# EAGLE design Sensor_HallArray_StandAlone_5mm (EAGLE 9.6.2)
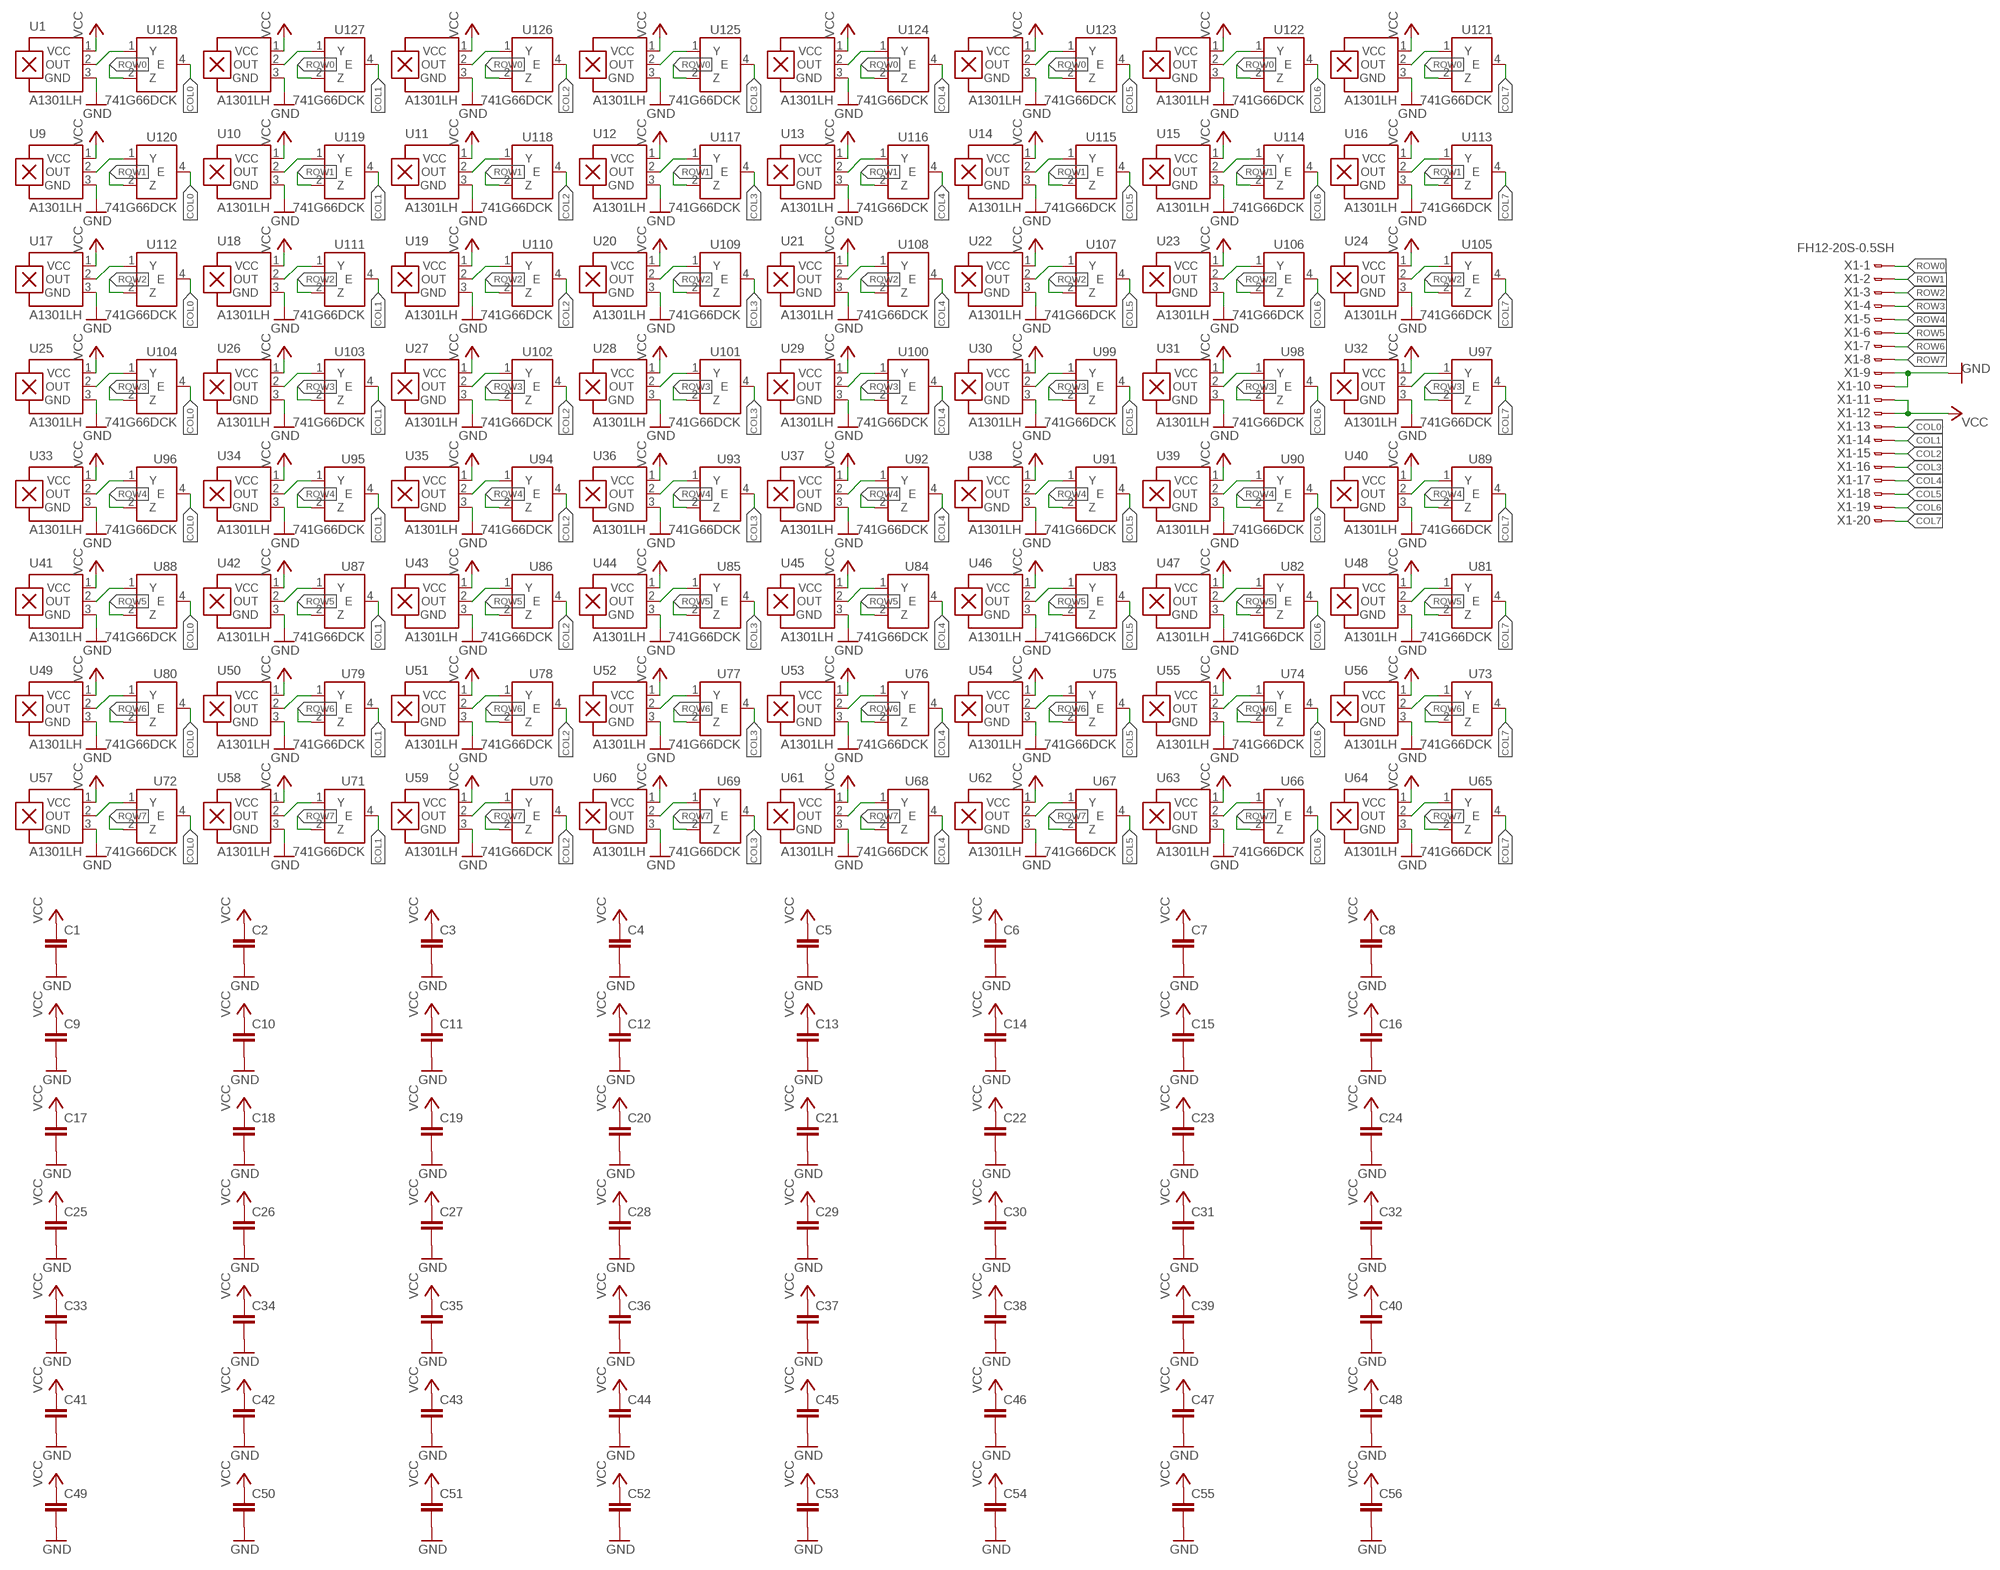
[diagram p0: schematic, sheet 1]

## Parts
C1  C-EUC0402  [C0402]
C2  C-EUC0402  [C0402]
C3  C-EUC0402  [C0402]
C4  C-EUC0402  [C0402]
C5  C-EUC0402  [C0402]
C6  C-EUC0402  [C0402]
C7  C-EUC0402  [C0402]
C8  C-EUC0402  [C0402]
C9  C-EUC0402  [C0402]
C10  C-EUC0402  [C0402]
C11  C-EUC0402  [C0402]
C12  C-EUC0402  [C0402]
C13  C-EUC0402  [C0402]
C14  C-EUC0402  [C0402]
C15  C-EUC0402  [C0402]
C16  C-EUC0402  [C0402]
C17  C-EUC0402  [C0402]
C18  C-EUC0402  [C0402]
C19  C-EUC0402  [C0402]
C20  C-EUC0402  [C0402]
C21  C-EUC0402  [C0402]
C22  C-EUC0402  [C0402]
C23  C-EUC0402  [C0402]
C24  C-EUC0402  [C0402]
C25  C-EUC0402  [C0402]
C26  C-EUC0402  [C0402]
C27  C-EUC0402  [C0402]
C28  C-EUC0402  [C0402]
C29  C-EUC0402  [C0402]
C30  C-EUC0402  [C0402]
C31  C-EUC0402  [C0402]
C32  C-EUC0402  [C0402]
C33  C-EUC0402  [C0402]
C34  C-EUC0402  [C0402]
C35  C-EUC0402  [C0402]
C36  C-EUC0402  [C0402]
C37  C-EUC0402  [C0402]
C38  C-EUC0402  [C0402]
C39  C-EUC0402  [C0402]
C40  C-EUC0402  [C0402]
C41  C-EUC0402  [C0402]
C42  C-EUC0402  [C0402]
C43  C-EUC0402  [C0402]
C44  C-EUC0402  [C0402]
C45  C-EUC0402  [C0402]
C46  C-EUC0402  [C0402]
C47  C-EUC0402  [C0402]
C48  C-EUC0402  [C0402]
C49  C-EUC0402  [C0402]
C50  C-EUC0402  [C0402]
C51  C-EUC0402  [C0402]
C52  C-EUC0402  [C0402]
C53  C-EUC0402  [C0402]
C54  C-EUC0402  [C0402]
C55  C-EUC0402  [C0402]
C56  C-EUC0402  [C0402]
U1  A1301LH  [SOT23-W]
U2  A1301LH  [SOT23-W]
U3  A1301LH  [SOT23-W]
U4  A1301LH  [SOT23-W]
U5  A1301LH  [SOT23-W]
U6  A1301LH  [SOT23-W]
U7  A1301LH  [SOT23-W]
U8  A1301LH  [SOT23-W]
U9  A1301LH  [SOT23-W]
U10  A1301LH  [SOT23-W]
U11  A1301LH  [SOT23-W]
U12  A1301LH  [SOT23-W]
U13  A1301LH  [SOT23-W]
U14  A1301LH  [SOT23-W]
U15  A1301LH  [SOT23-W]
U16  A1301LH  [SOT23-W]
U17  A1301LH  [SOT23-W]
U18  A1301LH  [SOT23-W]
U19  A1301LH  [SOT23-W]
U20  A1301LH  [SOT23-W]
U21  A1301LH  [SOT23-W]
U22  A1301LH  [SOT23-W]
U23  A1301LH  [SOT23-W]
U24  A1301LH  [SOT23-W]
U25  A1301LH  [SOT23-W]
U26  A1301LH  [SOT23-W]
U27  A1301LH  [SOT23-W]
U28  A1301LH  [SOT23-W]
U29  A1301LH  [SOT23-W]
U30  A1301LH  [SOT23-W]
U31  A1301LH  [SOT23-W]
U32  A1301LH  [SOT23-W]
U33  A1301LH  [SOT23-W]
U34  A1301LH  [SOT23-W]
U35  A1301LH  [SOT23-W]
U36  A1301LH  [SOT23-W]
U37  A1301LH  [SOT23-W]
U38  A1301LH  [SOT23-W]
U39  A1301LH  [SOT23-W]
U40  A1301LH  [SOT23-W]
U41  A1301LH  [SOT23-W]
U42  A1301LH  [SOT23-W]
U43  A1301LH  [SOT23-W]
U44  A1301LH  [SOT23-W]
U45  A1301LH  [SOT23-W]
U46  A1301LH  [SOT23-W]
U47  A1301LH  [SOT23-W]
U48  A1301LH  [SOT23-W]
U49  A1301LH  [SOT23-W]
U50  A1301LH  [SOT23-W]
U51  A1301LH  [SOT23-W]
U52  A1301LH  [SOT23-W]
U53  A1301LH  [SOT23-W]
U54  A1301LH  [SOT23-W]
U55  A1301LH  [SOT23-W]
U56  A1301LH  [SOT23-W]
U57  A1301LH  [SOT23-W]
U58  A1301LH  [SOT23-W]
U59  A1301LH  [SOT23-W]
U60  A1301LH  [SOT23-W]
U61  A1301LH  [SOT23-W]
U62  A1301LH  [SOT23-W]
U63  A1301LH  [SOT23-W]
U64  A1301LH  [SOT23-W]
U65  741G66DCK  [SC70-5]
U66  741G66DCK  [SC70-5]
U67  741G66DCK  [SC70-5]
U68  741G66DCK  [SC70-5]
U69  741G66DCK  [SC70-5]
U70  741G66DCK  [SC70-5]
U71  741G66DCK  [SC70-5]
U72  741G66DCK  [SC70-5]
U73  741G66DCK  [SC70-5]
U74  741G66DCK  [SC70-5]
U75  741G66DCK  [SC70-5]
U76  741G66DCK  [SC70-5]
U77  741G66DCK  [SC70-5]
U78  741G66DCK  [SC70-5]
U79  741G66DCK  [SC70-5]
U80  741G66DCK  [SC70-5]
U81  741G66DCK  [SC70-5]
U82  741G66DCK  [SC70-5]
U83  741G66DCK  [SC70-5]
U84  741G66DCK  [SC70-5]
U85  741G66DCK  [SC70-5]
U86  741G66DCK  [SC70-5]
U87  741G66DCK  [SC70-5]
U88  741G66DCK  [SC70-5]
U89  741G66DCK  [SC70-5]
U90  741G66DCK  [SC70-5]
U91  741G66DCK  [SC70-5]
U92  741G66DCK  [SC70-5]
U93  741G66DCK  [SC70-5]
U94  741G66DCK  [SC70-5]
U95  741G66DCK  [SC70-5]
U96  741G66DCK  [SC70-5]
U97  741G66DCK  [SC70-5]
U98  741G66DCK  [SC70-5]
U99  741G66DCK  [SC70-5]
U100  741G66DCK  [SC70-5]
U101  741G66DCK  [SC70-5]
U102  741G66DCK  [SC70-5]
U103  741G66DCK  [SC70-5]
U104  741G66DCK  [SC70-5]
U105  741G66DCK  [SC70-5]
U106  741G66DCK  [SC70-5]
U107  741G66DCK  [SC70-5]
U108  741G66DCK  [SC70-5]
U109  741G66DCK  [SC70-5]
U110  741G66DCK  [SC70-5]
U111  741G66DCK  [SC70-5]
U112  741G66DCK  [SC70-5]
U113  741G66DCK  [SC70-5]
U114  741G66DCK  [SC70-5]
U115  741G66DCK  [SC70-5]
U116  741G66DCK  [SC70-5]
U117  741G66DCK  [SC70-5]
U118  741G66DCK  [SC70-5]
U119  741G66DCK  [SC70-5]
U120  741G66DCK  [SC70-5]
U121  741G66DCK  [SC70-5]
U122  741G66DCK  [SC70-5]
U123  741G66DCK  [SC70-5]
U124  741G66DCK  [SC70-5]
U125  741G66DCK  [SC70-5]
U126  741G66DCK  [SC70-5]
U127  741G66DCK  [SC70-5]
U128  741G66DCK  [SC70-5]
X1  FH12-20S-0.5SH  [FH12-20S-0.5SH]

## Nets
COL0: U72.4(E) U80.4(E) U88.4(E) U96.4(E) U104.4(E) U112.4(E) U120.4(E) U128.4(E) X1.13
COL1: U71.4(E) U79.4(E) U87.4(E) U95.4(E) U103.4(E) U111.4(E) U119.4(E) U127.4(E) X1.14
COL2: U70.4(E) U78.4(E) U86.4(E) U94.4(E) U102.4(E) U110.4(E) U118.4(E) U126.4(E) X1.15
COL3: U69.4(E) U77.4(E) U85.4(E) U93.4(E) U101.4(E) U109.4(E) U117.4(E) U125.4(E) X1.16
COL4: U68.4(E) U76.4(E) U84.4(E) U92.4(E) U100.4(E) U108.4(E) U116.4(E) U124.4(E) X1.17
COL5: U67.4(E) U75.4(E) U83.4(E) U91.4(E) U99.4(E) U107.4(E) U115.4(E) U123.4(E) X1.18
COL6: U66.4(E) U74.4(E) U82.4(E) U90.4(E) U98.4(E) U106.4(E) U114.4(E) U122.4(E) X1.19
COL7: U65.4(E) U73.4(E) U81.4(E) U89.4(E) U97.4(E) U105.4(E) U113.4(E) U121.4(E) X1.20
GND: C1.2 C2.2 C3.2 C4.2 C5.2 C6.2 C7.2 C8.2 C9.2 C10.2 C11.2 C12.2 C13.2 C14.2 C15.2 C16.2 C17.2 C18.2 C19.2 C20.2 C21.2 C22.2 C23.2 C24.2 C25.2 C26.2 C27.2 C28.2 C29.2 C30.2 C31.2 C32.2 C33.2 C34.2 C35.2 C36.2 C37.2 C38.2 C39.2 C40.2 C41.2 C42.2 C43.2 C44.2 C45.2 C46.2 C47.2 C48.2 C49.2 C50.2 C51.2 C52.2 C53.2 C54.2 C55.2 C56.2 U1.3(GND) U2.3(GND) U3.3(GND) U4.3(GND) U5.3(GND) U6.3(GND) U7.3(GND) U8.3(GND) U9.3(GND) U10.3(GND) U11.3(GND) U12.3(GND) U13.3(GND) U14.3(GND) U15.3(GND) U16.3(GND) U17.3(GND) U18.3(GND) U19.3(GND) U20.3(GND) U21.3(GND) U22.3(GND) U23.3(GND) U24.3(GND) U25.3(GND) U26.3(GND) U27.3(GND) U28.3(GND) U29.3(GND) U30.3(GND) U31.3(GND) U32.3(GND) U33.3(GND) U34.3(GND) U35.3(GND) U36.3(GND) U37.3(GND) U38.3(GND) U39.3(GND) U40.3(GND) U41.3(GND) U42.3(GND) U43.3(GND) U44.3(GND) U45.3(GND) U46.3(GND) U47.3(GND) U48.3(GND) U49.3(GND) U50.3(GND) U51.3(GND) U52.3(GND) U53.3(GND) U54.3(GND) U55.3(GND) U56.3(GND) U57.3(GND) U58.3(GND) U59.3(GND) U60.3(GND) U61.3(GND) U62.3(GND) U63.3(GND) U64.3(GND) X1.9 X1.10
N$00001: U1.2(OUT) U128.1(Y)
N$00002: U2.2(OUT) U127.1(Y)
N$00003: U9.2(OUT) U120.1(Y)
N$00004: U3.2(OUT) U126.1(Y)
N$00005: U4.2(OUT) U125.1(Y)
N$00006: U5.2(OUT) U124.1(Y)
N$00007: U6.2(OUT) U123.1(Y)
N$00008: U7.2(OUT) U122.1(Y)
N$00009: U8.2(OUT) U121.1(Y)
N$00010: U10.2(OUT) U119.1(Y)
N$00011: U11.2(OUT) U118.1(Y)
N$00012: U12.2(OUT) U117.1(Y)
N$00013: U13.2(OUT) U116.1(Y)
N$00014: U14.2(OUT) U115.1(Y)
N$00015: U15.2(OUT) U114.1(Y)
N$00016: U16.2(OUT) U113.1(Y)
N$00017: U17.2(OUT) U112.1(Y)
N$00018: U18.2(OUT) U111.1(Y)
N$00019: U19.2(OUT) U110.1(Y)
N$00020: U20.2(OUT) U109.1(Y)
N$00021: U21.2(OUT) U108.1(Y)
N$00022: U22.2(OUT) U107.1(Y)
N$00023: U23.2(OUT) U106.1(Y)
N$00024: U24.2(OUT) U105.1(Y)
N$00025: U25.2(OUT) U104.1(Y)
N$00026: U26.2(OUT) U103.1(Y)
N$00029: U27.2(OUT) U102.1(Y)
N$00030: U28.2(OUT) U101.1(Y)
N$00031: U29.2(OUT) U100.1(Y)
N$00032: U30.2(OUT) U99.1(Y)
N$00033: U31.2(OUT) U98.1(Y)
N$00034: U32.2(OUT) U97.1(Y)
N$00035: U33.2(OUT) U96.1(Y)
N$00036: U34.2(OUT) U95.1(Y)
N$00037: U35.2(OUT) U94.1(Y)
N$00038: U36.2(OUT) U93.1(Y)
N$00039: U37.2(OUT) U92.1(Y)
N$00040: U38.2(OUT) U91.1(Y)
N$00041: U39.2(OUT) U90.1(Y)
N$00042: U40.2(OUT) U89.1(Y)
N$00043: U41.2(OUT) U88.1(Y)
N$00045: U42.2(OUT) U87.1(Y)
N$00046: U43.2(OUT) U86.1(Y)
N$00047: U44.2(OUT) U85.1(Y)
N$00048: U45.2(OUT) U84.1(Y)
N$00049: U46.2(OUT) U83.1(Y)
N$00051: U47.2(OUT) U82.1(Y)
N$00052: U48.2(OUT) U81.1(Y)
N$00053: U49.2(OUT) U80.1(Y)
N$00054: U50.2(OUT) U79.1(Y)
N$00055: U51.2(OUT) U78.1(Y)
N$00056: U52.2(OUT) U77.1(Y)
N$00057: U53.2(OUT) U76.1(Y)
N$00058: U54.2(OUT) U75.1(Y)
N$00059: U55.2(OUT) U74.1(Y)
N$00060: U56.2(OUT) U73.1(Y)
N$00061: U57.2(OUT) U72.1(Y)
N$00062: U58.2(OUT) U71.1(Y)
N$00063: U59.2(OUT) U70.1(Y)
N$00064: U60.2(OUT) U69.1(Y)
N$00065: U61.2(OUT) U68.1(Y)
N$00066: U62.2(OUT) U67.1(Y)
N$00067: U63.2(OUT) U66.1(Y)
N$00068: U64.2(OUT) U65.1(Y)
ROW0: U121.2(Z) U122.2(Z) U123.2(Z) U124.2(Z) U125.2(Z) U126.2(Z) U127.2(Z) U128.2(Z) X1.1
ROW1: U113.2(Z) U114.2(Z) U115.2(Z) U116.2(Z) U117.2(Z) U118.2(Z) U119.2(Z) U120.2(Z) X1.2
ROW2: U105.2(Z) U106.2(Z) U107.2(Z) U108.2(Z) U109.2(Z) U110.2(Z) U111.2(Z) U112.2(Z) X1.3
ROW3: U97.2(Z) U98.2(Z) U99.2(Z) U100.2(Z) U101.2(Z) U102.2(Z) U103.2(Z) U104.2(Z) X1.4
ROW4: U89.2(Z) U90.2(Z) U91.2(Z) U92.2(Z) U93.2(Z) U94.2(Z) U95.2(Z) U96.2(Z) X1.5
ROW5: U81.2(Z) U82.2(Z) U83.2(Z) U84.2(Z) U85.2(Z) U86.2(Z) U87.2(Z) U88.2(Z) X1.6
ROW6: U73.2(Z) U74.2(Z) U75.2(Z) U76.2(Z) U77.2(Z) U78.2(Z) U79.2(Z) U80.2(Z) X1.7
ROW7: U65.2(Z) U66.2(Z) U67.2(Z) U68.2(Z) U69.2(Z) U70.2(Z) U71.2(Z) U72.2(Z) X1.8
VCC: C1.1 C2.1 C3.1 C4.1 C5.1 C6.1 C7.1 C8.1 C9.1 C10.1 C11.1 C12.1 C13.1 C14.1 C15.1 C16.1 C17.1 C18.1 C19.1 C20.1 C21.1 C22.1 C23.1 C24.1 C25.1 C26.1 C27.1 C28.1 C29.1 C30.1 C31.1 C32.1 C33.1 C34.1 C35.1 C36.1 C37.1 C38.1 C39.1 C40.1 C41.1 C42.1 C43.1 C44.1 C45.1 C46.1 C47.1 C48.1 C49.1 C50.1 C51.1 C52.1 C53.1 C54.1 C55.1 C56.1 U1.1(VCC) U2.1(VCC) U3.1(VCC) U4.1(VCC) U5.1(VCC) U6.1(VCC) U7.1(VCC) U8.1(VCC) U9.1(VCC) U10.1(VCC) U11.1(VCC) U12.1(VCC) U13.1(VCC) U14.1(VCC) U15.1(VCC) U16.1(VCC) U17.1(VCC) U18.1(VCC) U19.1(VCC) U20.1(VCC) U21.1(VCC) U22.1(VCC) U23.1(VCC) U24.1(VCC) U25.1(VCC) U26.1(VCC) U27.1(VCC) U28.1(VCC) U29.1(VCC) U30.1(VCC) U31.1(VCC) U32.1(VCC) U33.1(VCC) U34.1(VCC) U35.1(VCC) U36.1(VCC) U37.1(VCC) U38.1(VCC) U39.1(VCC) U40.1(VCC) U41.1(VCC) U42.1(VCC) U43.1(VCC) U44.1(VCC) U45.1(VCC) U46.1(VCC) U47.1(VCC) U48.1(VCC) U49.1(VCC) U50.1(VCC) U51.1(VCC) U52.1(VCC) U53.1(VCC) U54.1(VCC) U55.1(VCC) U56.1(VCC) U57.1(VCC) U58.1(VCC) U59.1(VCC) U60.1(VCC) U61.1(VCC) U62.1(VCC) U63.1(VCC) U64.1(VCC) X1.11 X1.12

## Power pins joined to a net without a drawn wire
GND: U65.3(GND) U66.3(GND) U67.3(GND) U68.3(GND) U69.3(GND) U70.3(GND) U71.3(GND) U72.3(GND) U73.3(GND) U74.3(GND) U75.3(GND) U76.3(GND) U77.3(GND) U78.3(GND) U79.3(GND) U80.3(GND) U81.3(GND) U82.3(GND) U83.3(GND) U84.3(GND) U85.3(GND) U86.3(GND) U87.3(GND) U88.3(GND) U89.3(GND) U90.3(GND) U91.3(GND) U92.3(GND) U93.3(GND) U94.3(GND) U95.3(GND) U96.3(GND) U97.3(GND) U98.3(GND) U99.3(GND) U100.3(GND) U101.3(GND) U102.3(GND) U103.3(GND) U104.3(GND) U105.3(GND) U106.3(GND) U107.3(GND) U108.3(GND) U109.3(GND) U110.3(GND) U111.3(GND) U112.3(GND) U113.3(GND) U114.3(GND) U115.3(GND) U116.3(GND) U117.3(GND) U118.3(GND) U119.3(GND) U120.3(GND) U121.3(GND) U122.3(GND) U123.3(GND) U124.3(GND) U125.3(GND) U126.3(GND) U127.3(GND) U128.3(GND)
VCC: U65.5(VCC) U66.5(VCC) U67.5(VCC) U68.5(VCC) U69.5(VCC) U70.5(VCC) U71.5(VCC) U72.5(VCC) U73.5(VCC) U74.5(VCC) U75.5(VCC) U76.5(VCC) U77.5(VCC) U78.5(VCC) U79.5(VCC) U80.5(VCC) U81.5(VCC) U82.5(VCC) U83.5(VCC) U84.5(VCC) U85.5(VCC) U86.5(VCC) U87.5(VCC) U88.5(VCC) U89.5(VCC) U90.5(VCC) U91.5(VCC) U92.5(VCC) U93.5(VCC) U94.5(VCC) U95.5(VCC) U96.5(VCC) U97.5(VCC) U98.5(VCC) U99.5(VCC) U100.5(VCC) U101.5(VCC) U102.5(VCC) U103.5(VCC) U104.5(VCC) U105.5(VCC) U106.5(VCC) U107.5(VCC) U108.5(VCC) U109.5(VCC) U110.5(VCC) U111.5(VCC) U112.5(VCC) U113.5(VCC) U114.5(VCC) U115.5(VCC) U116.5(VCC) U117.5(VCC) U118.5(VCC) U119.5(VCC) U120.5(VCC) U121.5(VCC) U122.5(VCC) U123.5(VCC) U124.5(VCC) U125.5(VCC) U126.5(VCC) U127.5(VCC) U128.5(VCC)

## Library data of the parts
C1-C56 = rcl:C-EU: CAPACITOR, European symbol; SPICEPREFIX: C
U1-U64 = allegro:A13*?: Linear Hall Effect Sensor ICs Continuous-Time Ratiometric High-Temperature Operation Programmable Linear with Analog Output A1302 -Replacement- UGN3503 Source: http://www.allegromicro.com/en/Products/Part_Numbers/1301/1301.pdf http://www.allegromicro.com/en/Products/Part_Numbers/1321/1321.pdf http://www.allegromicro.com/en/Products/Part_Numbers/1381/1381.pdf; MF: ALLEGRO MICROSYSTEMS, INC.; MPN: A1301ELHLT-T; OC_FARNELL: 1198084; OC_NEWARK: 31K6634
U65-U128 = 74xx-little-de:74*1G66: Single Analog / Bilateral Switch Source: http://www.semiconductors.philips.com/acrobat_download/datasheets/74HC_HCT1G66_3.pdf
X1 = con-hirose:FH12-20S-0.5S: 0.5mm Pitch Connectors For FPC/FFC Source: Data sheet <http://www.hirose.co.jp/cataloge_hp/e58605370.pdf>; MPN: FH12-20S-0.5SH(55); OC_FARNELL: 1324549; OC_NEWARK: 34M6166

## Board
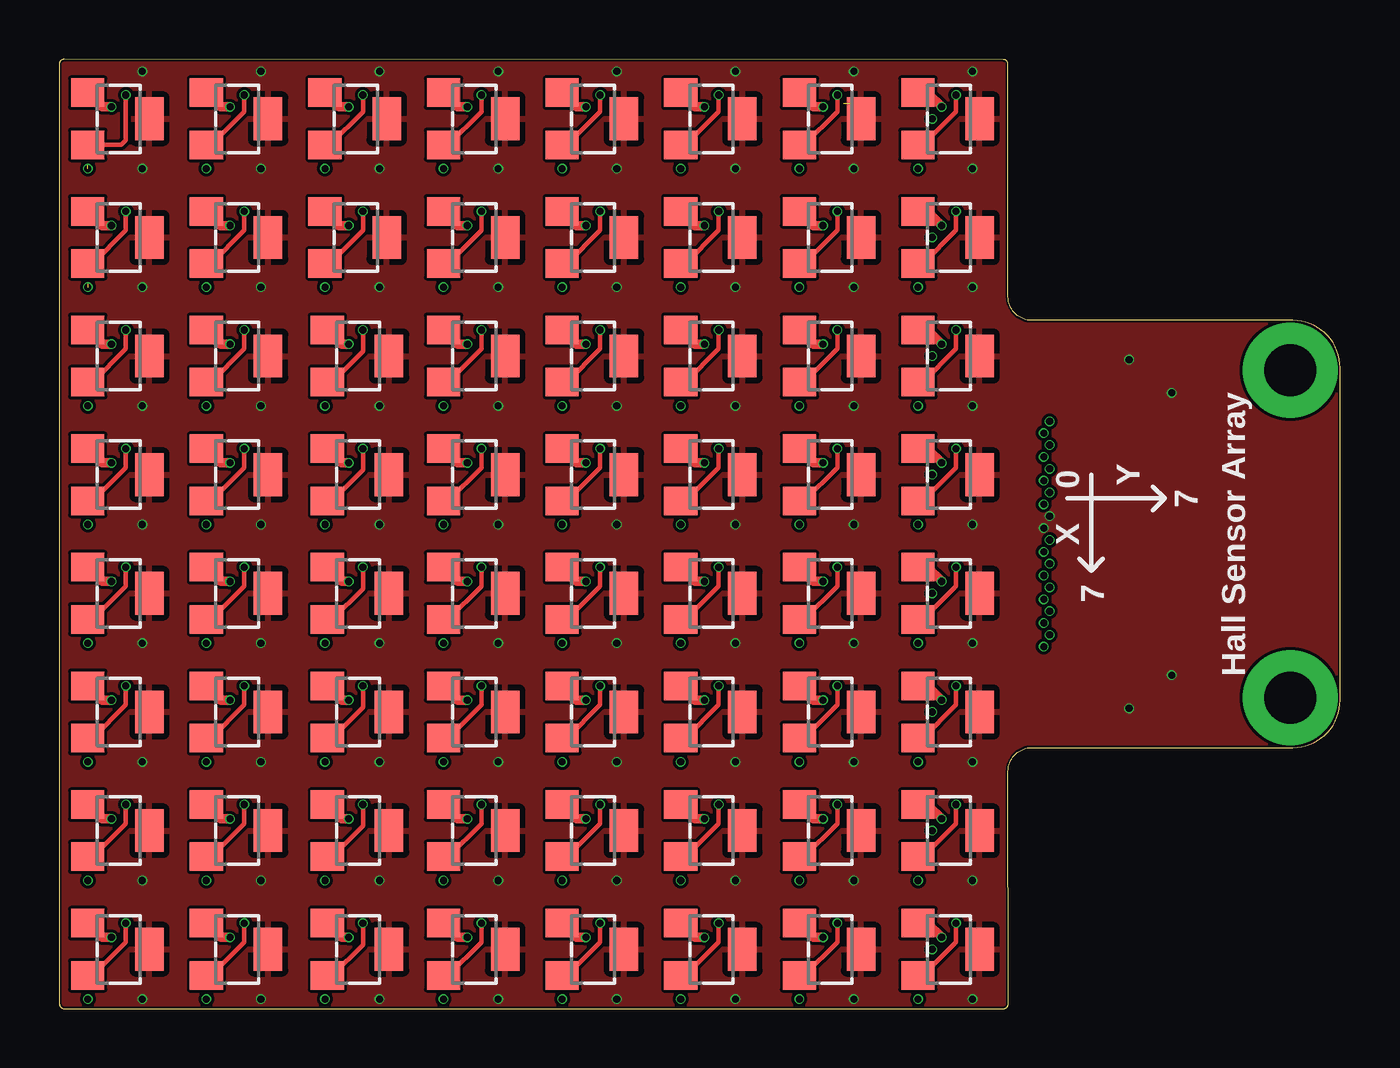
[diagram p1: board, top side]
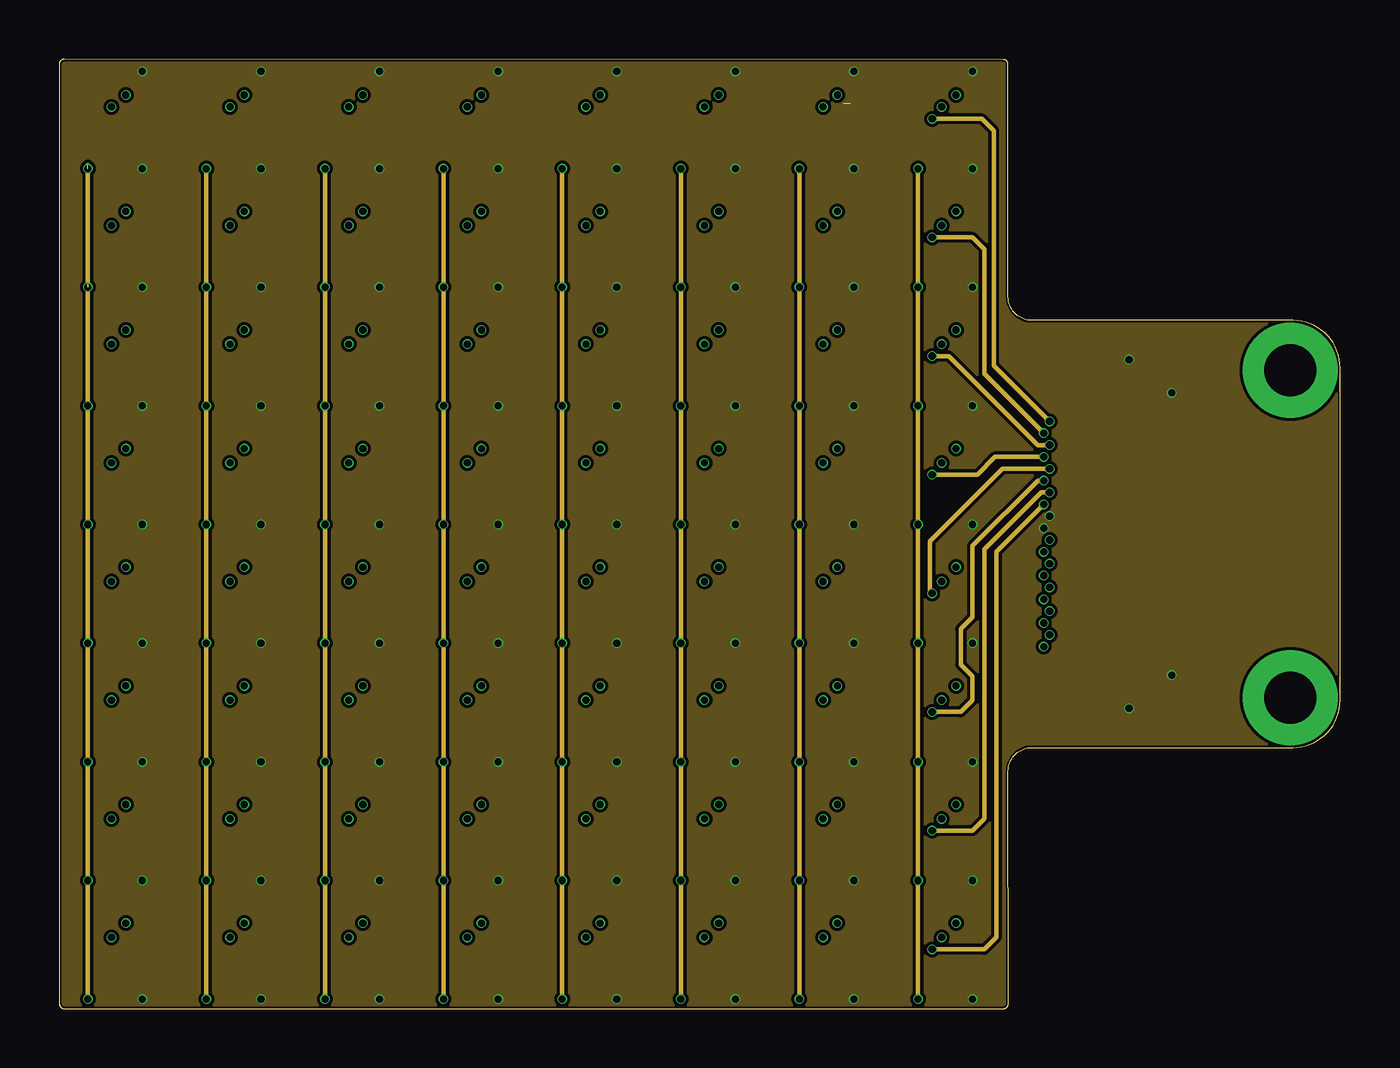
[diagram p2: board, inner layer Route2]
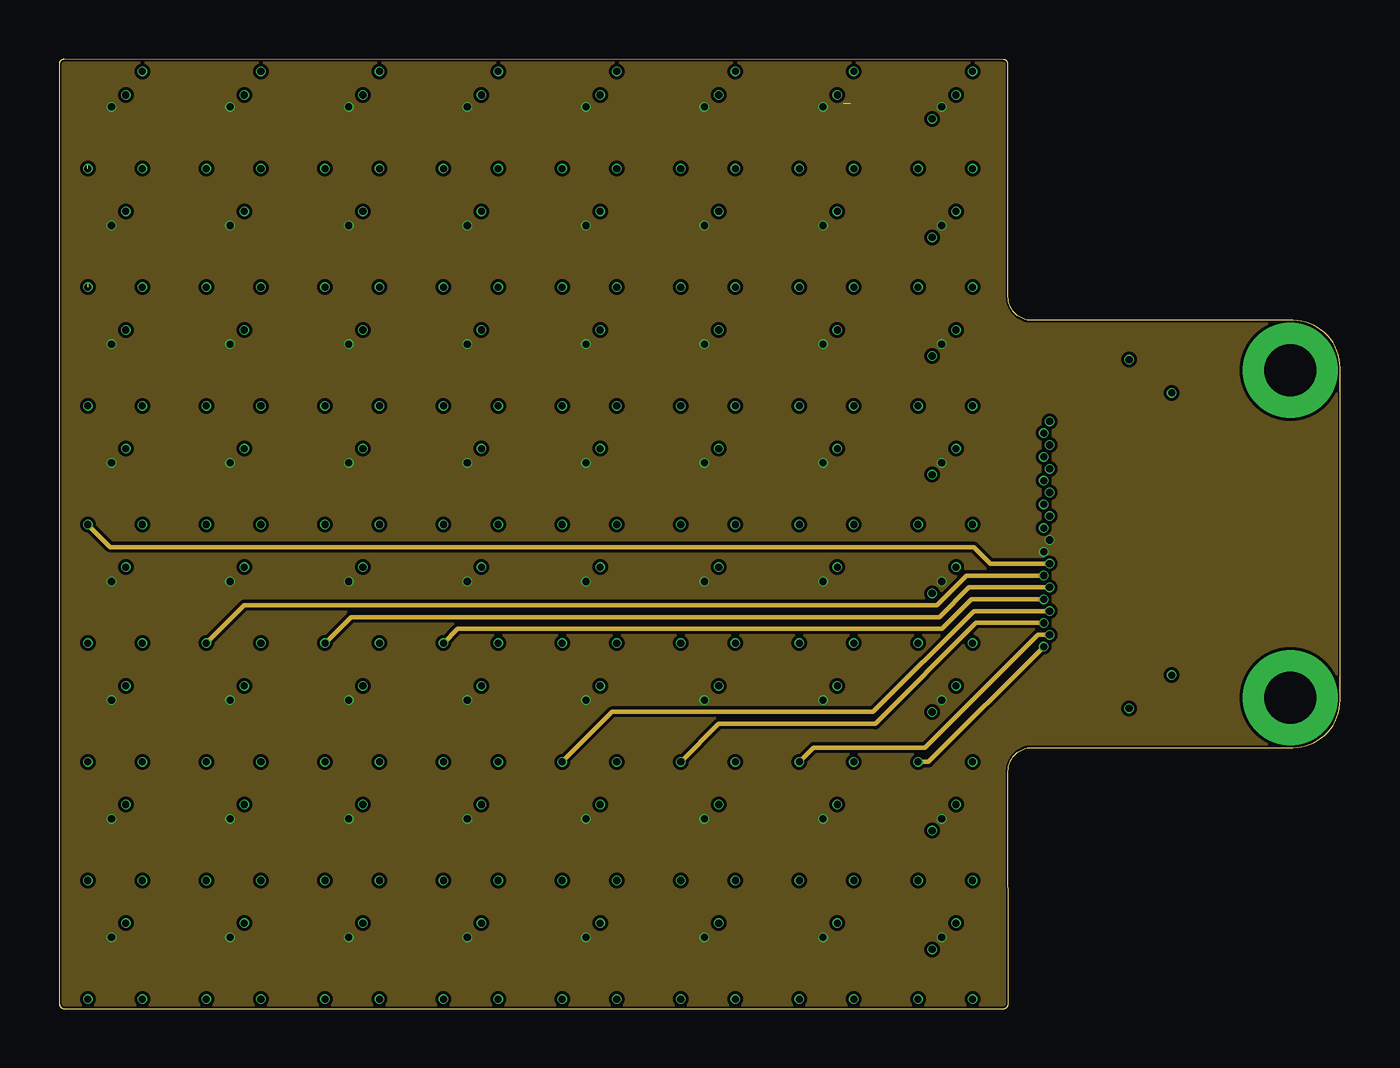
[diagram p3: board, inner layer Route15]
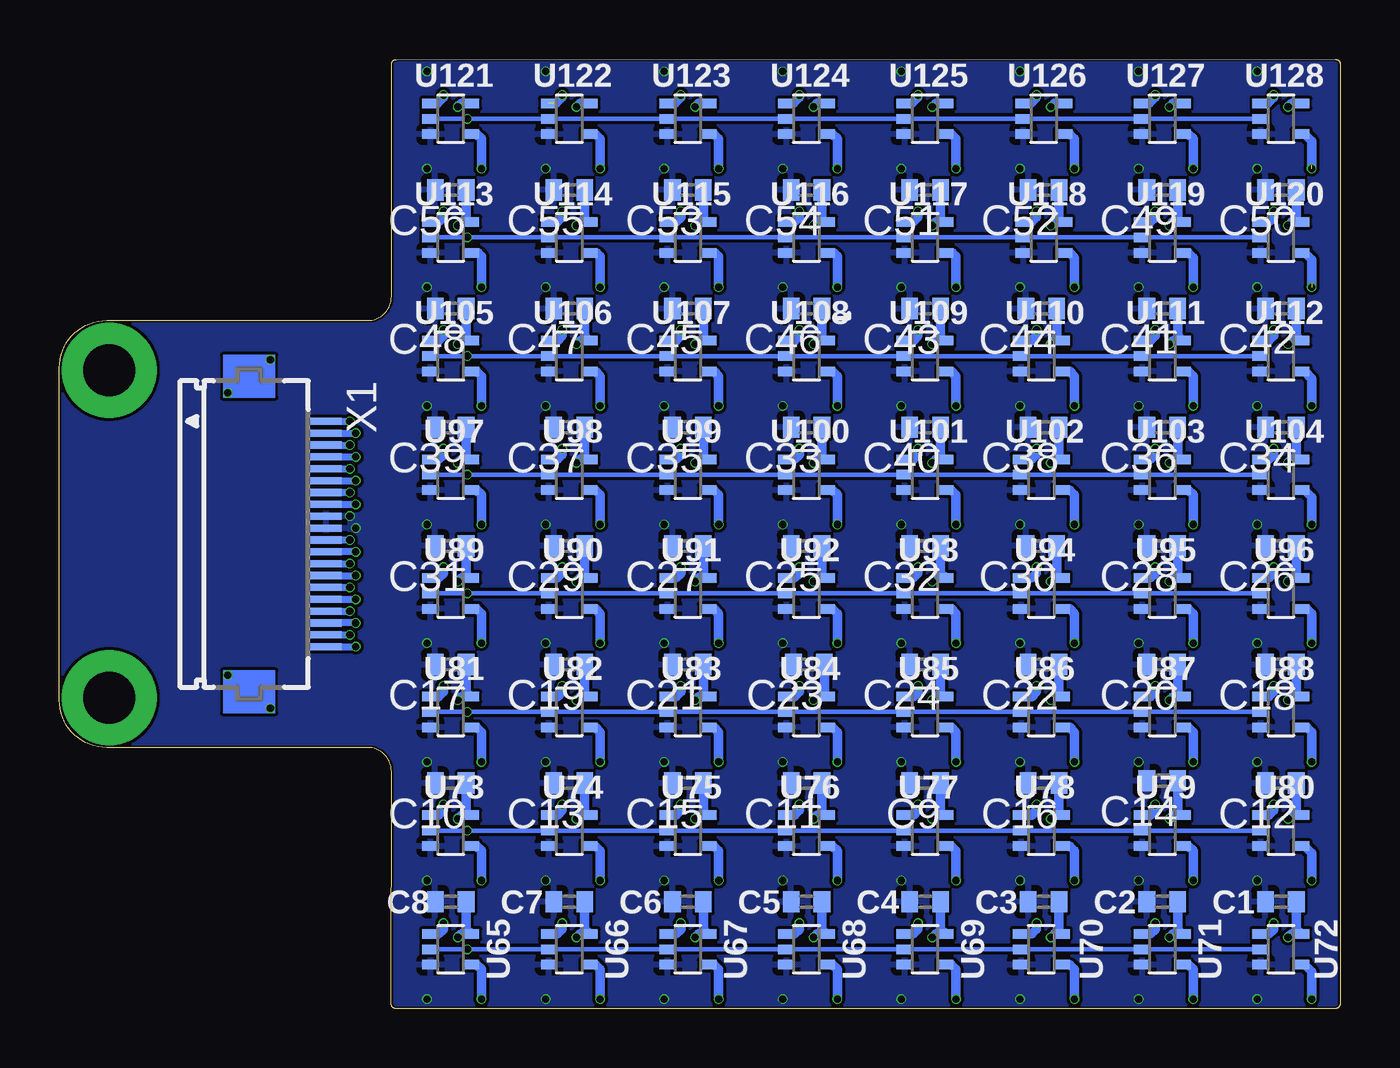
[diagram p4: board, bottom side, seen from below]

Size 54 x 40 mm. Coordinates in mm from the lower left corner, seen from the top.
Outline: 40,30 40,39.79 arc90 39.8,39.99 0.2,40 arc88 0,39.81 0,0.19 arc90 0.2,0 39.8,0 arc90 40,0.2 40,10 arc-90 41,11 52,11 arc90 54,13 54,27 arc90 52,29 41,29 arc-90 40,30
Copper layers (1*2*15*16): Top 0.035559375mm / dielectric 0.17018125mm / Route2 0.01778125mm / dielectric 47mil / Route15 0.01778125mm / dielectric 0.17018125mm / Bottom 0.035559375mm
Design rules "jlcpcb-4-layer *": minimum track width 5mil, minimum drill 0.2mm, track to track 5mil, track to pad 5mil, pad to pad 5mil, via to via 5mil, smd to smd 0mil, copper to edge 0.1mm, drill to drill 5mil, minimum pad ring 0.1mm, minimum via ring 0.05mm, stop-mask expansion 3mil, vias tented up to drill 100mil, thermal gap 10mil

### Footprints (pad centres in the part's own frame; a part is rotated, then mirrored left to right if it is on the bottom)
C0402 = smd 0.7 x 0.9: 1 -0.65,0; 2 0.65,0
SOT23-W = smd 1.2 x 1.4: 1 -1.1,-1.3; 2 1.1,-1.3 | smd 1.8 x 1.2: 3 0,1.3
SC70-5 = smd 0.4 x 0.7: 1 -0.65,-0.85; 2 0,-0.85; 3 0.65,-0.85; 4 0.65,0.85; 5 -0.65,0.85
FH12-20S-0.5SH = smd 0.3 x 1.3: 1 -4.75,3.25; 2 -4.25,3.25; 3 -3.75,3.25; 4 -3.25,3.25; 5 -2.75,3.25; 6 -2.25,3.25; 7 -1.75,3.25; 8 -1.25,3.25; 9 -0.75,3.25; 10 -0.25,3.25; 11 0.25,3.25; 12 0.75,3.25; 13 1.25,3.25; 14 1.75,3.25; 15 2.25,3.25; 16 2.75,3.25; 17 3.25,3.25; 18 3.75,3.25; 19 4.25,3.25; 20 4.75,3.25

### Placement (x,y rotation side)
C1  2.5,4.5 180 bottom
C2  7.5,4.5 180 bottom
C3  12.5,4.5 180 bottom
C4  17.5,4.5 180 bottom
C5  22.5,4.5 180 bottom
C6  27.5,4.5 180 bottom
C7  32.5,4.5 180 bottom
C8  37.5,4.5 180 bottom
C9  17.5,9.5 180 bottom
C10  37.5,9.5 180 bottom
C11  22.5,9.5 180 bottom
C12  2.5,9.5 180 bottom
C13  32.5,9.5 180 bottom
C14  7.5,9.6 180 bottom
C15  27.5,9.5 180 bottom
C16  12.5,9.5 180 bottom
C17  37.5,14.5 180 bottom
C18  2.5,14.5 180 bottom
C19  32.5,14.5 180 bottom
C20  7.5,14.5 180 bottom
C21  27.5,14.5 180 bottom
C22  12.5,14.5 180 bottom
C23  22.4,14.5 180 bottom
C24  17.5,14.5 180 bottom
C25  22.5,19.5 180 bottom
C26  2.5,19.5 180 bottom
C27  27.5,19.5 180 bottom
C28  7.5,19.5 180 bottom
C29  32.5,19.5 180 bottom
C30  12.6,19.5 180 bottom
C31  37.5,19.5 180 bottom
C32  17.5,19.5 180 bottom
C33  22.5,24.5 180 bottom
C34  2.5,24.5 180 bottom
C35  27.5,24.5 180 bottom
C36  7.5,24.5 180 bottom
C37  32.5,24.5 180 bottom
C38  12.5,24.5 180 bottom
C39  37.5,24.5 180 bottom
C40  17.5,24.5 180 bottom
C41  7.5,29.5 180 bottom
C42  2.5,29.5 180 bottom
C43  17.5,29.5 180 bottom
C44  12.6,29.5 180 bottom
C45  27.5,29.5 180 bottom
C46  22.5,29.5 180 bottom
C47  32.5,29.5 180 bottom
C48  37.5,29.5 180 bottom
C49  7.5,34.5 180 bottom
C50  2.5,34.5 180 bottom
C51  17.5,34.5 180 bottom
C52  12.5,34.5 180 bottom
C53  27.5,34.5 180 bottom
C54  22.5,34.5 180 bottom
C55  32.5,34.5 180 bottom
C56  37.5,34.5 180 bottom
U1  2.5,37.5 270 top
U2  7.5,37.5 270 top
U3  12.5,37.5 270 top
U4  17.5,37.5 270 top
U5  22.5,37.5 270 top
U6  27.5,37.5 270 top
U7  32.5,37.5 270 top
U8  37.5,37.5 270 top
U9  2.5,32.5 270 top
U10  7.5,32.5 270 top
U11  12.5,32.5 270 top
U12  17.5,32.5 270 top
U13  22.5,32.5 270 top
U14  27.5,32.5 270 top
U15  32.5,32.5 270 top
U16  37.5,32.5 270 top
U17  2.5,27.5 270 top
U18  7.5,27.5 270 top
U19  12.6,27.5 270 top
U20  17.5,27.5 270 top
U21  22.5,27.5 270 top
U22  27.5,27.5 270 top
U23  32.5,27.5 270 top
U24  37.5,27.5 270 top
U25  2.5,22.5 270 top
U26  7.5,22.5 270 top
U27  12.6,22.5 270 top
U28  17.5,22.5 270 top
U29  22.5,22.5 270 top
U30  27.5,22.5 270 top
U31  32.5,22.5 270 top
U32  37.5,22.5 270 top
U33  2.5,17.5 270 top
U34  7.5,17.5 270 top
U35  12.6,17.5 270 top
U36  17.5,17.5 270 top
U37  22.5,17.5 270 top
U38  27.5,17.5 270 top
U39  32.5,17.5 270 top
U40  37.5,17.5 270 top
U41  2.5,12.5 270 top
U42  7.5,12.5 270 top
U43  12.6,12.5 270 top
U44  17.5,12.5 270 top
U45  22.5,12.5 270 top
U46  27.5,12.5 270 top
U47  32.5,12.5 270 top
U48  37.5,12.5 270 top
U49  2.5,7.5 270 top
U50  7.5,7.5 270 top
U51  12.6,7.5 270 top
U52  17.5,7.5 270 top
U53  22.5,7.5 270 top
U54  27.5,7.5 270 top
U55  32.5,7.5 270 top
U56  37.5,7.5 270 top
U57  2.5,2.5 270 top
U58  7.5,2.5 270 top
U59  12.6,2.5 270 top
U60  17.5,2.5 270 top
U61  22.5,2.5 270 top
U62  27.5,2.5 270 top
U63  32.5,2.5 270 top
U64  37.5,2.5 270 top
U65  37.5,2.5 270 bottom
U66  32.5,2.5 270 bottom
U67  27.5,2.5 270 bottom
U68  22.5,2.5 270 bottom
U69  17.5,2.5 270 bottom
U70  12.6,2.5 270 bottom
U71  7.5,2.5 270 bottom
U72  2.5,2.5 270 bottom
U73  37.5,7.5 270 bottom
U74  32.5,7.5 270 bottom
U75  27.5,7.5 270 bottom
U76  22.5,7.5 270 bottom
U77  17.5,7.5 270 bottom
U78  12.6,7.5 270 bottom
U79  7.5,7.5 270 bottom
U80  2.5,7.5 270 bottom
U81  37.5,12.5 270 bottom
U82  32.5,12.5 270 bottom
U83  27.5,12.5 270 bottom
U84  22.5,12.5 270 bottom
U85  17.5,12.5 270 bottom
U86  12.6,12.5 270 bottom
U87  7.5,12.5 270 bottom
U88  2.5,12.5 270 bottom
U89  37.5,17.5 270 bottom
U90  32.5,17.5 270 bottom
U91  27.5,17.5 270 bottom
U92  22.5,17.5 270 bottom
U93  17.5,17.5 270 bottom
U94  12.6,17.5 270 bottom
U95  7.5,17.5 270 bottom
U96  2.5,17.5 270 bottom
U97  37.5,22.5 270 bottom
U98  32.5,22.5 270 bottom
U99  27.5,22.5 270 bottom
U100  22.5,22.5 270 bottom
U101  17.5,22.5 270 bottom
U102  12.6,22.5 270 bottom
U103  7.5,22.5 270 bottom
U104  2.5,22.5 270 bottom
U105  37.5,27.5 270 bottom
U106  32.5,27.5 270 bottom
U107  27.5,27.5 270 bottom
U108  22.5,27.5 270 bottom
U109  17.5,27.5 270 bottom
U110  12.6,27.5 270 bottom
U111  7.5,27.5 270 bottom
U112  2.5,27.5 270 bottom
U113  37.5,32.5 270 bottom
U114  32.5,32.5 270 bottom
U115  27.5,32.5 270 bottom
U116  22.5,32.5 270 bottom
U117  17.5,32.5 270 bottom
U118  12.5,32.5 270 bottom
U119  7.5,32.5 270 bottom
U120  2.5,32.5 270 bottom
U121  37.5,37.5 270 bottom
U122  32.5,37.5 270 bottom
U123  27.5,37.5 270 bottom
U124  22.5,37.5 270 bottom
U125  17.5,37.5 270 bottom
U126  12.5,37.5 270 bottom
U127  7.5,37.5 270 bottom
U128  2.5,37.5 270 bottom
X1  46,20 270 bottom

### Tracks (layer width: path | path; a pad name or v marks a point on that pad's centre or on a via)
COL0  (via drill 0.3)  (2 unrouted)
  Route2 0.2: 1.2,35.55 1.2,30.55 | v1.2,30.4 v1.2,25.4 v1.2,20.4 v1.2,15.4 v1.2,10.4 v1.2,5.4 v1.2,0.4
  Route15 0.2: v41.75,18.75 39.25,18.75 38.55,19.45 2.15,19.45 v1.2,20.4
  Bottom 0.3: X1.13 v41.75,18.75
  Bottom 0.4: v1.2,35.4 1.2,36.55 1.5,36.85 U128.4 | v1.2,30.4 1.2,31.55 1.5,31.85 U120.4 | v1.2,25.4 1.2,26.55 1.5,26.85 U112.4 | v1.2,20.4 1.2,21.55 1.5,21.85 U104.4 | v1.2,15.4 1.2,16.65 1.4,16.85 U96.4 | v1.2,10.4 1.2,11.65 1.4,11.85 U88.4 | v1.2,5.4 1.2,6.55 1.5,6.85 U80.4 | v1.2,0.4 1.2,1.55 1.5,1.85 U72.4
COL1  (via drill 0.3)
  Route2 0.2: v6.2,35.4 v6.2,30.4 v6.2,25.4 v6.2,20.4 v6.2,15.4 v6.2,10.4 v6.2,5.4 v6.2,0.4
  Route15 0.2: v41.5,18.25 38.25,18.25 37,17 7.8,17 v6.2,15.4
  Bottom 0.3: X1.14 v41.5,18.25
  Bottom 0.4: v6.2,35.4 6.2,36.65 6.4,36.85 U127.4 | v6.2,30.4 6.2,31.65 6.4,31.85 U119.4 | v6.2,25.4 6.2,26.65 6.4,26.85 U111.4 | v6.2,20.4 6.2,21.65 6.4,21.85 U103.4 | v6.2,15.4 6.2,16.65 6.4,16.85 U95.4 | v6.2,10.4 6.2,11.65 6.4,11.85 U87.4 | v6.2,5.4 6.2,6.65 6.4,6.85 U79.4 | v6.2,0.4 6.2,1.65 6.4,1.85 U71.4
COL2  (via drill 0.3)
  Route2 0.2: v11.2,35.4 v11.2,30.4 v11.2,25.4 v11.2,20.4 v11.2,15.4 v11.2,10.4 v11.2,5.4 v11.2,0.4
  Route15 0.2: v41.75,17.75 38.35,17.75 37.1,16.5 12.3,16.5 v11.2,15.4
  Bottom 0.3: X1.15 v41.75,17.75
  Bottom 0.4: v11.2,35.4 11.2,36.65 11.4,36.85 U126.4 | v11.2,30.4 11.2,31.65 11.4,31.85 U118.4 | v11.2,25.4 11.2,26.65 11.4,26.85 U110.4 | v11.2,20.4 11.2,21.65 11.4,21.85 U102.4 | v11.2,15.4 11.2,16.65 11.4,16.85 U94.4 | v11.2,0.4 11.2,1.65 11.4,1.85 U70.4 | v11.2,5.4 11.2,6.65 11.4,6.85 U78.4 | v11.2,10.4 11.2,11.65 11.4,11.85 U86.4
COL3  (via drill 0.3)
  Route2 0.2: v16.2,35.4 v16.2,30.4 v16.2,25.4 v16.2,20.4 v16.2,15.4 v16.2,10.4 v16.2,5.4 v16.2,0.4
  Route15 0.2: v41.5,17.25 38.45,17.25 37.2,16 16.8,16 v16.2,15.4
  Bottom 0.3: X1.16 v41.5,17.25
  Bottom 0.4: v16.2,35.4 16.2,36.65 16.4,36.85 U125.4 | v16.2,30.4 16.2,31.7 16.35,31.85 U117.4 | v16.2,25.4 16.2,26.65 16.4,26.85 U109.4 | v16.2,20.4 16.2,21.65 16.4,21.85 U101.4 | v16.2,15.4 16.2,16.65 16.4,16.85 U93.4 | v16.2,10.4 16.2,11.65 16.4,11.85 U85.4 | v16.2,5.4 16.2,6.65 16.4,6.85 U77.4 | v16.2,0.4 16.2,1.65 16.4,1.85 U69.4
COL4  (via drill 0.3)
  Route2 0.2: v21.2,35.4 v21.2,30.4 v21.2,25.4 v21.2,20.4 v21.2,15.4 v21.2,10.4 v21.2,5.4 v21.2,0.4
  Route15 0.2: v41.75,16.75 38.55,16.75 34.3,12.5 23.3,12.5 v21.2,10.4
  Bottom 0.3: X1.17 v41.75,16.75
  Bottom 0.4: v21.2,35.4 21.2,36.65 21.4,36.85 U124.4 | v21.2,30.4 21.2,31.7 21.35,31.85 U116.4 | v21.2,25.4 21.2,26.65 21.4,26.85 U108.4 | v21.2,20.4 21.2,21.65 21.4,21.85 U100.4 | v21.2,15.4 21.2,16.65 21.4,16.85 U92.4 | v21.2,10.4 21.2,11.65 21.4,11.85 U84.4 | v21.2,5.4 21.2,6.65 21.4,6.85 U76.4 | v21.2,0.4 21.2,1.65 21.4,1.85 U68.4
COL5  (via drill 0.3)
  Top 0.2: 26.15,25.45 v26.2,25.4
  Route2 0.2: v26.2,35.4 v26.2,30.4 v26.2,25.4 v26.2,20.4 v26.2,15.4 v26.2,10.4 v26.2,5.4 v26.2,0.4
  Route15 0.2: v41.5,16.25 38.65,16.25 34.4,12 27.8,12 v26.2,10.4
  Bottom 0.3: v41.5,16.25 X1.18
  Bottom 0.4: v26.2,35.4 26.2,36.65 26.4,36.85 U123.4 | v26.2,30.4 26.2,31.7 26.35,31.85 U115.4 | v26.2,25.4 26.2,26.65 26.4,26.85 U107.4 | v26.2,20.4 26.2,21.65 26.4,21.85 U99.4 | v26.2,15.4 26.2,16.65 26.4,16.85 U91.4 | v26.2,0.4 26.2,1.65 26.4,1.85 U67.4 | v26.2,5.4 26.2,6.65 26.4,6.85 U75.4 | v26.2,10.4 26.2,11.65 26.4,11.85 U83.4
COL6  (via drill 0.3)
  Route2 0.2: v31.2,35.4 v31.2,30.4 v31.2,25.4 v31.2,20.4 v31.2,15.4 v31.2,10.4 v31.2,5.4 v31.2,0.4
  Route15 0.2: v41.75,15.75 41.25,15.75 36.5,11 31.8,11 v31.2,10.4
  Bottom 0.3: X1.19 v41.75,15.75
  Bottom 0.4: v31.2,35.4 31.2,36.65 31.4,36.85 U122.4 | v31.2,30.4 31.2,31.7 31.35,31.85 U114.4 | v31.2,25.4 31.2,26.65 31.4,26.85 U106.4 | v31.2,20.4 31.2,21.65 31.4,21.85 U98.4 | v31.2,15.4 31.2,16.65 31.4,16.85 U90.4 | v31.2,10.4 31.2,11.65 31.4,11.85 U82.4 | v31.2,0.4 31.2,1.65 31.4,1.85 U66.4 | v31.2,5.4 31.2,6.65 31.4,6.85 U74.4
COL7  (via drill 0.3)
  Top 0.2: 36.15,25.45 v36.2,25.4
  Route2 0.2: v36.2,35.4 v36.2,30.4 v36.2,25.4 v36.2,20.4 v36.2,15.4 v36.2,10.4 v36.2,5.4 v36.2,0.4
  Route15 0.2: v36.2,10.4 36.65,10.4 v41.5,15.25
  Bottom 0.3: X1.20 v41.5,15.25
  Bottom 0.4: v36.2,35.4 36.2,36.65 36.4,36.85 U121.4 | v36.2,30.4 36.2,31.7 36.35,31.85 U113.4 | v36.2,25.4 36.2,26.65 36.4,26.85 U105.4 | v36.2,20.4 36.2,21.65 36.4,21.85 U97.4 | v36.2,15.4 36.2,16.65 36.4,16.85 U89.4 | v36.2,10.4 36.2,11.65 36.4,11.85 U81.4 | v36.2,5.4 36.2,6.65 36.4,6.85 U73.4 | v36.2,0.4 36.2,1.65 36.4,1.85 U65.4
GND  (via drill 0.3)
  other vias: 3.5,35.4 8.5,35.4 13.5,35.4 18.5,35.4 23.5,35.4 28.5,35.4 33.5,35.4 38.5,35.4 3.5,5.4 8.5,5.4 13.5,5.4 18.5,5.4 23.5,5.4 28.5,5.4 33.5,5.4 38.5,5.4 3.5,10.4 8.5,10.4 13.5,10.4 18.5,10.4 23.5,10.4 28.5,10.4 33.5,10.4 38.5,10.4 3.5,0.4 8.5,0.4 13.5,0.4 18.5,0.4 23.5,0.4 28.5,0.4 33.5,0.4 38.5,0.4 3.5,15.4 8.5,15.4 13.5,15.4 18.5,15.4 23.5,15.4 28.5,15.4 33.5,15.4 38.5,15.4 3.5,20.4 8.5,20.4 13.5,20.4 18.5,20.4 23.5,20.4 28.5,20.4 33.5,20.4 38.5,20.4 3.5,25.4 8.5,25.4 13.5,25.4 18.5,25.4 23.5,25.4 28.5,25.4 33.5,25.4 38.5,25.4 3.5,30.4 8.5,30.4 13.5,30.4 18.5,30.4 23.5,30.4 28.5,30.4 33.5,30.4 38.5,30.4 3.5,39.5 8.5,39.5 13.5,39.5 18.5,39.5 23.5,39.5 28.5,39.5 33.5,39.5 38.5,39.5 41.75,20.75 41.5,20.25 45.1,27.35 46.9,25.95 46.9,14.05 45.1,12.65
  pour Top: 0,0 40,0 40,10 arc-90 41,11 52,11 arc90 54,13 54,27 arc90 52,29 41,29 arc-90 40,30 40,40 0,40
  pour Bottom: 0,0 40,0 40,10 arc-90 41,11 52,11 arc90 54,13 54,27 arc90 52,29 41,29 arc-90 40,30 40,40 0,40
  pour Route2: 0,0 40,0 40,10 arc-90 41,11 52,11 arc90 54,13 54,27 arc90 52,29 41,29 arc-90 40,30 40,40 0,40
N$00001  (via drill 0.3)
  Top 0.2: U1.2 2.6,36.4 2.8,36.6 v2.8,38.5
  Bottom 0.4: v2.8,38.5 2.8,38.4 3.05,38.15 U128.1
N$00002  (via drill 0.3)
  Top 0.2: U2.2 6.4,36.4 7.8,37.8 v7.8,38.5
  Bottom 0.4: v7.8,38.5 7.8,38.4 8.05,38.15 U127.1
N$00003  (via drill 0.3)
  Top 0.2: U9.2 1.4,31.4 2.8,32.8 v2.8,33.6
  Bottom 0.4: U120.1 3,33.15 2.8,33.35 v2.8,33.6
N$00004  (via drill 0.3)
  Top 0.2: U3.2 11.4,36.4 12.8,37.8 v12.8,38.5
  Bottom 0.4: v12.8,38.5 12.8,38.4 13.05,38.15 U126.1
N$00005  (via drill 0.3)
  Top 0.2: U4.2 16.4,36.4 17.8,37.8 v17.8,38.5
  Bottom 0.4: v17.8,38.5 17.8,38.4 18.05,38.15 U125.1
N$00006  (via drill 0.3)
  Top 0.2: U5.2 21.4,36.4 22.8,37.8 v22.8,38.5
  Bottom 0.4: v22.8,38.5 22.8,38.4 23.05,38.15 U124.1
N$00007  (via drill 0.3)
  Top 0.2: U6.2 26.4,36.4 27.8,37.8 v27.8,38.5
  Bottom 0.4: v27.8,38.5 27.8,38.4 28.05,38.15 U123.1
N$00008  (via drill 0.3)  (1 unrouted)
  Top 0.2: U7.2 31.4,36.4 32.8,37.8 v32.8,38.5
  Bottom 0.4: 33.05,38.15 32.8,38.4 v32.8,38.5
N$00009  (via drill 0.3)
  Top 0.2: U8.2 36.4,36.4 37.8,37.8 v37.8,38.5
  Bottom 0.4: U121.1 38.05,38.15 37.8,38.4 v37.8,38.5
N$00010  (via drill 0.3)
  Top 0.2: U10.2 6.4,31.4 7.8,32.8 v7.8,33.6
  Bottom 0.4: U119.1 8,33.15 7.8,33.35 v7.8,33.6
N$00011  (via drill 0.3)
  Top 0.2: U11.2 11.4,31.4 12.8,32.8 v12.8,33.6
  Bottom 0.4: U118.1 13,33.15 12.8,33.35 v12.8,33.6
N$00012  (via drill 0.3)
  Top 0.2: U12.2 16.4,31.4 17.8,32.8 v17.8,33.6
  Bottom 0.4: U117.1 18,33.15 17.8,33.35 v17.8,33.6
N$00013  (via drill 0.3)
  Top 0.2: U13.2 21.4,31.4 22.8,32.8 v22.8,33.6
  Bottom 0.4: U116.1 23,33.15 22.8,33.35 v22.8,33.6
N$00014  (via drill 0.3)
  Top 0.2: U14.2 26.4,31.4 27.8,32.8 v27.8,33.6
  Bottom 0.4: U115.1 28,33.15 27.8,33.35 v27.8,33.6
N$00015  (via drill 0.3)
  Top 0.2: U15.2 31.4,31.4 32.8,32.8 v32.8,33.6
  Bottom 0.4: U114.1 33,33.15 32.8,33.35 v32.8,33.6
N$00016  (via drill 0.3)
  Top 0.2: U16.2 36.4,31.4 37.8,32.8 v37.8,33.6
  Bottom 0.4: U113.1 38,33.15 37.8,33.35 v37.8,33.6
N$00017  (via drill 0.3)
  Top 0.2: U17.2 1.4,26.4 2.8,27.8 v2.8,28.6
  Bottom 0.4: U112.1 3,28.15 2.8,28.35 v2.8,28.6
N$00018  (via drill 0.3)
  Top 0.2: U18.2 6.4,26.4 7.8,27.8 v7.8,28.6
  Bottom 0.4: U111.1 8,28.15 7.8,28.35 v7.8,28.6
N$00019  (via drill 0.3)
  Top 0.2: U19.2 11.5,26.4 12.8,27.7 v12.8,28.6
  Bottom 0.4: U110.1 13,28.15 12.8,28.35 v12.8,28.6
N$00020  (via drill 0.3)
  Top 0.2: U20.2 16.4,26.4 17.8,27.8 v17.8,28.6
  Bottom 0.4: U109.1 18,28.15 17.8,28.35 v17.8,28.6
N$00021  (via drill 0.3)
  Top 0.2: U21.2 21.4,26.4 22.8,27.8 v22.8,28.6
  Bottom 0.4: U108.1 23,28.15 22.8,28.35 v22.8,28.6
N$00022  (via drill 0.3)
  Top 0.2: U22.2 26.4,26.4 27.8,27.8 v27.8,28.6
  Bottom 0.4: U107.1 28,28.15 27.8,28.35 v27.8,28.6
N$00023  (via drill 0.3)
  Top 0.2: U23.2 31.4,26.4 32.8,27.8 v32.8,28.6
  Bottom 0.4: U106.1 33,28.15 32.8,28.35 v32.8,28.6
N$00024  (via drill 0.3)
  Top 0.2: U24.2 36.4,26.4 37.8,27.8 v37.8,28.6
  Bottom 0.4: U105.1 38,28.15 37.8,28.35 v37.8,28.6
N$00025  (via drill 0.3)
  Top 0.2: U25.2 1.4,21.4 2.8,22.8 v2.8,23.6
  Bottom 0.4: U104.1 3,23.15 2.8,23.35 v2.8,23.6
N$00026  (via drill 0.3)
  Top 0.2: U26.2 6.4,21.4 7.8,22.8 v7.8,23.6
  Bottom 0.4: U103.1 8,23.15 7.8,23.35 v7.8,23.6
N$00027  (via drill 2.2 pad 4)
  other vias: 51.9,26.9
N$00028  (via drill 2.2 pad 4)
  other vias: 51.9,13.1
N$00029  (via drill 0.3)
  Top 0.2: U27.2 11.5,21.4 12.8,22.7 v12.8,23.6
  Bottom 0.4: U102.1 13,23.15 12.8,23.35 v12.8,23.6
N$00030  (via drill 0.3)
  Top 0.2: U28.2 16.4,21.4 17.8,22.8 v17.8,23.6
  Bottom 0.4: U101.1 18,23.15 17.8,23.35 v17.8,23.6
N$00031  (via drill 0.3)
  Top 0.2: U29.2 21.4,21.4 22.8,22.8 v22.8,23.6
  Bottom 0.4: U100.1 23,23.15 22.8,23.35 v22.8,23.6
N$00032  (via drill 0.3)
  Top 0.2: U30.2 26.4,21.4 27.8,22.8 v27.8,23.6
  Bottom 0.4: U99.1 28,23.15 27.8,23.35 v27.8,23.6
N$00033  (via drill 0.3)
  Top 0.2: U31.2 31.4,21.4 32.8,22.8 v32.8,23.6
  Bottom 0.4: U98.1 33,23.15 32.8,23.35 v32.8,23.6
N$00034  (via drill 0.3)
  Top 0.2: U32.2 36.4,21.4 37.8,22.8 v37.8,23.6
  Bottom 0.4: U97.1 38,23.15 37.8,23.35 v37.8,23.6
N$00035  (via drill 0.3)
  Top 0.2: U33.2 1.4,16.4 2.8,17.8 v2.8,18.6
  Bottom 0.4: U96.1 3,18.15 2.8,18.35 v2.8,18.6
N$00036  (via drill 0.3)
  Top 0.2: U34.2 6.4,16.4 7.8,17.8 v7.8,18.6
  Bottom 0.4: U95.1 8,18.15 7.8,18.35 v7.8,18.6
N$00037  (via drill 0.3)
  Top 0.2: U35.2 11.5,16.4 12.8,17.7 v12.8,18.6
  Bottom 0.4: U94.1 13,18.15 12.8,18.35 v12.8,18.6
N$00038  (via drill 0.3)
  Top 0.2: U36.2 16.4,16.4 17.8,17.8 v17.8,18.6
  Bottom 0.4: U93.1 18,18.15 17.8,18.35 v17.8,18.6
N$00039  (via drill 0.3)
  Top 0.2: U37.2 21.4,16.4 22.8,17.8 v22.8,18.6
  Bottom 0.4: U92.1 23,18.15 22.8,18.35 v22.8,18.6
N$00040  (via drill 0.3)
  Top 0.2: U38.2 26.4,16.4 27.8,17.8 v27.8,18.6
  Bottom 0.4: U91.1 28,18.15 27.8,18.35 v27.8,18.6
N$00041  (via drill 0.3)
  Top 0.2: U39.2 31.4,16.4 32.8,17.8 v32.8,18.6
  Bottom 0.4: U90.1 33,18.15 32.8,18.35 v32.8,18.6
N$00042  (via drill 0.3)
  Top 0.2: U40.2 36.4,16.4 37.8,17.8 v37.8,18.6
  Bottom 0.4: U89.1 38,18.15 37.8,18.35 v37.8,18.6
N$00043  (via drill 0.3)
  Top 0.2: U41.2 1.4,11.4 2.8,12.8 v2.8,13.6
  Bottom 0.4: U88.1 3,13.15 2.8,13.35 v2.8,13.6
N$00045  (via drill 0.3)
  Top 0.2: U42.2 6.4,11.4 7.8,12.8 v7.8,13.6
  Bottom 0.4: U87.1 8,13.15 7.8,13.35 v7.8,13.6
N$00046  (via drill 0.3)
  Top 0.2: U43.2 11.5,11.4 12.8,12.7 v12.8,13.6
  Bottom 0.4: U86.1 13,13.15 12.8,13.35 v12.8,13.6
N$00047  (via drill 0.3)
  Top 0.2: U44.2 16.4,11.4 17.8,12.8 v17.8,13.6
  Bottom 0.4: U85.1 18,13.15 17.8,13.35 v17.8,13.6
N$00048  (via drill 0.3)
  Top 0.2: U45.2 21.4,11.4 22.8,12.8 v22.8,13.6
  Bottom 0.4: U84.1 23,13.15 22.8,13.35 v22.8,13.6
N$00049  (via drill 0.3)
  Top 0.2: U46.2 26.4,11.4 27.8,12.8 v27.8,13.6
  Bottom 0.4: U83.1 28,13.15 27.8,13.35 v27.8,13.6
N$00051  (via drill 0.3)
  Top 0.2: U47.2 31.4,11.4 32.8,12.8 v32.8,13.6
  Bottom 0.4: U82.1 33,13.15 32.8,13.35 v32.8,13.6
N$00052  (via drill 0.3)
  Top 0.2: U48.2 36.4,11.4 37.8,12.8 v37.8,13.6
  Bottom 0.4: U81.1 38,13.15 37.8,13.35 v37.8,13.6
N$00053  (via drill 0.3)
  Top 0.2: U49.2 1.4,6.4 2.8,7.8 v2.8,8.6
  Bottom 0.4: U80.1 3,8.15 2.8,8.35 v2.8,8.6
N$00054  (via drill 0.3)
  Top 0.2: U50.2 6.4,6.4 7.8,7.8 v7.8,8.6
  Bottom 0.4: U79.1 8,8.15 7.8,8.35 v7.8,8.6
N$00055  (via drill 0.3)
  Top 0.2: U51.2 11.5,6.4 12.8,7.7 v12.8,8.6
  Bottom 0.4: U78.1 13,8.15 12.8,8.35 v12.8,8.6
N$00056  (via drill 0.3)
  Top 0.2: U52.2 16.4,6.4 17.8,7.8 v17.8,8.6
  Bottom 0.4: U77.1 18,8.15 17.8,8.35 v17.8,8.6
N$00057  (via drill 0.3)
  Top 0.2: U53.2 21.4,6.4 22.8,7.8 v22.8,8.6
  Bottom 0.4: U76.1 23,8.15 22.8,8.35 v22.8,8.6
N$00058  (via drill 0.3)
  Top 0.2: U54.2 26.4,6.4 27.8,7.8 v27.8,8.6
  Bottom 0.4: U75.1 28,8.15 27.8,8.35 v27.8,8.6
N$00059  (via drill 0.3)
  Top 0.2: U55.2 31.4,6.4 32.8,7.8 v32.8,8.6
  Bottom 0.4: U74.1 33,8.15 32.8,8.35 v32.8,8.6
N$00060  (via drill 0.3)
  Top 0.2: U56.2 36.4,6.4 37.8,7.8 v37.8,8.6
  Bottom 0.4: U73.1 38,8.15 37.8,8.35 v37.8,8.6
N$00061  (via drill 0.3)
  Top 0.2: U57.2 1.4,1.4 2.8,2.8 v2.8,3.6
  Bottom 0.4: U72.1 3,3.15 2.8,3.35 v2.8,3.6
N$00062  (via drill 0.3)
  Top 0.2: U58.2 6.4,1.4 7.8,2.8 v7.8,3.6
  Bottom 0.4: U71.1 8,3.15 7.8,3.35 v7.8,3.6
N$00063  (via drill 0.3)
  Top 0.2: U59.2 11.5,1.4 12.8,2.7 v12.8,3.6
  Bottom 0.4: U70.1 13,3.15 12.8,3.35 v12.8,3.6
N$00064  (via drill 0.3)
  Top 0.2: U60.2 16.4,1.4 17.8,2.8 v17.8,3.6
  Bottom 0.4: U69.1 18,3.15 17.8,3.35 v17.8,3.6
N$00065  (via drill 0.3)
  Top 0.2: U61.2 21.4,1.4 22.8,2.8 v22.8,3.6
  Bottom 0.4: U68.1 23,3.15 22.8,3.35 v22.8,3.6
N$00066  (via drill 0.3)
  Top 0.2: U62.2 26.4,1.4 27.8,2.8 v27.8,3.6
  Bottom 0.4: U67.1 28,3.15 27.8,3.35 v27.8,3.6
N$00067  (via drill 0.3)
  Top 0.2: U63.2 31.4,1.4 32.8,2.8 v32.8,3.6
  Bottom 0.4: U66.1 33,3.15 32.8,3.35 v32.8,3.6
N$00068  (via drill 0.3)
  Top 0.2: U64.2 36.4,1.4 37.8,2.8 v37.8,3.6
  Bottom 0.4: U65.1 38,3.15 37.8,3.35 v37.8,3.6
ROW0  (via drill 0.3)
  Route2 0.2: v41.75,24.75 39.4,27.1 39.4,37 38.9,37.5 v36.8,37.5
  Bottom 0.2: U128.2 U127.2 U126.2 U125.2 U124.2 U123.2 U122.2 v36.8,37.5 U121.2
  Bottom 0.3: X1.1 v41.75,24.75
ROW1  (via drill 0.3)
  Route2 0.2: v41.5,24.25 39,26.75 39,32 38.5,32.5 v36.8,32.5
  Bottom 0.2: U120.2 U119.2 U118.2 U117.2 U116.2 U115.2 U114.2 v36.8,32.5 U113.2
  Bottom 0.3: X1.2 v41.5,24.25
ROW2  (via drill 0.3)
  Route2 0.2: v41.75,23.75 41.25,23.75 37.5,27.5 v36.8,27.5
  Bottom 0.2: U112.2 U111.2 U110.2 U109.2 U108.2 U107.2 U106.2 v36.8,27.5 U105.2
  Bottom 0.3: X1.3 v41.75,23.75
ROW3  (via drill 0.3)
  Route2 0.2: v41.5,23.25 39.45,23.25 38.7,22.5 v36.8,22.5
  Bottom 0.2: U104.2 U103.2 U102.2 U101.2 U100.2 U99.2 U98.2 v36.8,22.5 U97.2
  Bottom 0.3: X1.4 v41.5,23.25
ROW4  (via drill 0.3)
  Route2 0.2: v41.75,22.75 39.75,22.75 36.7,19.7 36.7,17.6 v36.8,17.5
  Bottom 0.2: U96.2 U95.2 U94.2 U93.2 U92.2 U91.2 U90.2 v36.8,17.5 U89.2
  Bottom 0.3: X1.5 v41.75,22.75
ROW5  (via drill 0.3)
  Route2 0.2: v41.5,22.25 41.25,22.25 38.5,19.5 38.5,16.5 38,16 38,14.5 38.5,14 38.5,13 38,12.5 v36.8,12.5
  Bottom 0.2: U88.2 U87.2 U86.2 U85.2 U84.2 U83.2 U82.2 v36.8,12.5 U81.2
  Bottom 0.3: X1.6 v41.5,22.25
ROW6  (via drill 0.3)
  Route2 0.2: v41.75,21.75 41.4,21.75 39,19.35 39,8 38.5,7.5 v36.8,7.5
  Bottom 0.2: U80.2 U79.2 U78.2 U77.2 U76.2 U75.2 U74.2 v36.8,7.5 U73.2
  Bottom 0.3: X1.7 v41.75,21.75
ROW7  (via drill 0.3)
  Route2 0.2: v41.5,21.25 39.5,19.25 39.5,3 39,2.5 v36.8,2.5
  Bottom 0.2: U72.2 U71.2 U70.2 U69.2 U68.2 U67.2 U66.2 v36.8,2.5 U65.2
  Bottom 0.3: X1.8 v41.5,21.25
VCC  (via drill 0.3)
  Top 0.152: 36.6,38.6 36.3,38.6 | 31.35,38.45 U7.1
  Top 0.4: v2.2,38 1.8,38 U1.1 | v7.2,38 6.8,38 U2.1 | U9.1 1.8,33 v2.2,33 | v12.2,38 11.8,38 U3.1 | v17.2,38 16.8,38 U4.1 | v22.2,38 21.8,38 U5.1 | v27.2,38 26.8,38 U6.1 | v32.2,38 31.8,38 31.35,38.45 | v2.2,28 1.8,28 U17.1 | v7.2,28 6.8,28 U18.1 | v12.2,28 11.9,28 U19.1 | v17.2,28 16.8,28 U20.1 | v22.2,28 21.8,28 U21.1 | v27.2,28 26.8,28 U22.1 | v32.2,28 31.8,28 U23.1 | v37.2,28 36.6,28.6 U24.1 | U25.1 1.8,23 v2.2,23 | U26.1 6.8,23 v7.2,23 | U27.1 11.9,23 v12.2,23 | U28.1 16.8,23 v17.2,23 | U29.1 21.8,23 v22.2,23 | U30.1 26.8,23 v27.2,23 | U31.1 31.8,23 v32.2,23 | v37.2,23 36.6,23.6 U32.1 | v37.2,18 36.6,18.6 U40.1 | v32.2,18 31.8,18 U39.1 | v27.2,18 26.8,18 U38.1 | v22.2,18 21.8,18 U37.1 | v17.2,18 16.8,18 U36.1 | v12.2,18 11.9,18 U35.1 | v7.2,18 6.8,18 U34.1 | v2.2,18 1.8,18 U33.1 | U48.1 36.6,13.6 v37.2,13 | U47.1 31.8,13 v32.2,13 | U46.1 26.8,13 v27.2,13 | U45.1 21.8,13 v22.2,13 | U44.1 16.8,13 v17.2,13 | U43.1 11.9,13 v12.2,13 | U42.1 6.8,13 v7.2,13 | U41.1 1.8,13 v2.2,13 | v37.2,3 36.6,3.6 U64.1 | v37.2,8 36.6,8.6 U56.1 | v32.2,8 31.8,8 U55.1 | v32.2,3 31.8,3 U63.1 | v27.2,3 26.8,3 U62.1 | v27.2,8 26.8,8 U54.1 | v22.2,8 21.8,8 U53.1 | v22.2,3 21.8,3 U61.1 | v17.2,3 16.8,3 U60.1 | v17.2,8 16.8,8 U52.1 | v12.2,8 11.9,8 U51.1 | v12.2,3 11.9,3 U59.1 | v7.2,3 6.8,3 U58.1 | v7.2,8 6.8,8 U50.1 | v2.2,8 1.8,8 U49.1 | v2.2,3 1.8,3 U57.1 | v37.2,33 36.6,33.6 U16.1 | v32.2,33 31.8,33 U15.1 | U14.1 26.8,33 v27.2,33 | U13.1 21.8,33 v22.2,33 | U12.1 16.8,33 v17.2,33 | U11.1 11.8,33 v12.2,33 | U10.1 6.8,33 v7.2,33 | U8.1 36.3,38.6 | v37.2,38 36.6,38.6
  Bottom 0.3: X1.11 v41.75,19.75 | v41.5,19.25 X1.12
  Bottom 0.4: U127.5 7.05,38.15 v7.2,38 | U128.5 2.05,38.15 v2.2,38 | U126.5 12.05,38.15 v12.2,38 | U125.5 17.05,38.15 v17.2,38 | U124.5 22.05,38.15 v22.2,38 | U123.5 27.05,38.15 v27.2,38 | U122.5 32.05,38.15 v32.2,38 | U121.5 37.05,38.15 v37.2,38 | U113.5 36.9,33.15 | 36.9,33.15 37.05,33.15 v37.2,33 | U114.5 31.8,33.15 | 31.8,33.15 32.05,33.15 v32.2,33 | U115.5 26.8,33.15 | 26.8,33.15 27.05,33.15 v27.2,33 | U116.5 21.8,33.15 | 21.8,33.15 22.05,33.15 v22.2,33 | U117.5 16.8,33.15 | 16.8,33.15 17.05,33.15 v17.2,33 | U118.5 11.8,33.15 | 11.8,33.15 12.05,33.15 v12.2,33 | U119.5 6.8,33.15 | 6.8,33.15 7.05,33.15 v7.2,33 | U120.5 1.8,33.15 | 1.8,33.15 2.05,33.15 v2.2,33 | v2.2,3 2.05,3.15 U72.5 1.85,3.35 C1.1 | U80.5 1.8,8.15 | 1.8,8.15 2.05,8.15 v2.2,8 | U79.5 6.9,8.15 | 6.9,8.15 7.05,8.15 v7.2,8 | v7.2,3 7.05,3.15 U71.5 6.85,3.35 C2.1 | U88.5 1.8,13.15 | 1.8,13.15 2.05,13.15 v2.2,13 | U87.5 6.8,13.15 | 6.8,13.15 7.05,13.15 v7.2,13 | U95.5 6.7,18.15 | 6.7,18.15 7.05,18.15 v7.2,18 | U96.5 1.8,18.15 | 1.8,18.15 2.05,18.15 v2.2,18 | U104.5 1.8,23.15 | 1.8,23.15 2.05,23.15 v2.2,23 | U103.5 6.8,23.15 | 6.8,23.15 7.05,23.15 v7.2,23 | U102.5 11.8,23.15 | 11.8,23.15 12.05,23.15 v12.2,23 | v2.2,28 2.05,28.15 U112.5 1.85,28.35 C42.1 | v7.2,28 7.05,28.15 U111.5 6.85,28.35 C41.1 | U110.5 11.9,28.15 | 11.9,28.15 12.05,28.15 v12.2,28 | U109.5 16.8,28.15 | 16.8,28.15 17.05,28.15 v17.2,28 | U108.5 21.9,28.15 | 21.9,28.15 22.05,28.15 v22.2,28 | U107.5 26.8,28.15 | 26.8,28.15 27.05,28.15 v27.2,28 | v32.2,28 32.05,28.15 U106.5 31.85,28.35 C47.1 | U105.5 36.8,28.15 | 36.8,28.15 37.05,28.15 v37.2,28 | U97.5 36.8,23.15 | 36.8,23.15 37.05,23.15 v37.2,23 | U98.5 31.8,23.15 | 31.8,23.15 32.05,23.15 v32.2,23
  Bottom 0.4: U99.5 26.9,23.15 | 26.9,23.15 27.05,23.15 v27.2,23 | U100.5 21.8,23.15 | 21.8,23.15 22.05,23.15 v22.2,23 | U101.5 16.9,23.15 | 16.9,23.15 17.05,23.15 v17.2,23 | v17.2,18 17.05,18.15 U93.5 16.85,18.35 C32.1 | U92.5 21.9,18.15 | 21.9,18.15 22.05,18.15 v22.2,18 | U94.5 12.05,18.15 | 12.05,18.15 v12.2,18 | U91.5 26.9,18.15 | 26.9,18.15 27.05,18.15 v27.2,18 | U90.5 31.7,18.15 | 31.7,18.15 32.05,18.15 v32.2,18 | U89.5 36.8,18.15 | 36.8,18.15 37.05,18.15 v37.2,18 | v37.2,13 37.05,13.15 U81.5 36.85,13.35 C17.1 | U73.5 36.8,8.15 | 36.8,8.15 37.05,8.15 v37.2,8 | U74.5 31.8,8.15 | 31.8,8.15 32.05,8.15 v32.2,8 | U83.5 26.8,13.15 | 26.8,13.15 27.05,13.15 v27.2,13 | v22.2,13 22.05,13.15 U84.5 21.75,13.25 C23.1 | U76.5 21.8,8.15 | 21.8,8.15 22.05,8.15 v22.2,8 | U75.5 26.8,8.15 | 26.8,8.15 27.05,8.15 v27.2,8 | U85.5 16.9,13.15 | 16.9,13.15 17.05,13.15 v17.2,13 | v12.2,13 12.05,13.15 U86.5 11.85,13.25 C22.1 | v12.2,8 12.05,8.15 U78.5 11.85,8.25 C16.1 | U77.5 16.8,8.15 | 16.8,8.15 17.05,8.15 v17.2,8 | v17.2,3 17.05,3.15 U69.5 16.85,3.35 C4.1 | v12.2,3 12.05,3.15 U70.5 11.85,3.25 C3.1 | v22.2,3 22.05,3.15 U68.5 21.85,3.35 C5.1 | v27.2,3 27.05,3.15 U67.5 26.85,3.35 C6.1 | v32.2,3 32.05,3.15 U66.5 31.85,3.35 C7.1 | v37.2,3 37.05,3.15 U65.5 36.85,3.35 C8.1 | U82.5 31.9,13.15 | 31.9,13.15 32.05,13.15 v32.2,13 | C12.1 1.85,8.2 1.8,8.15 | C14.1 6.85,8.2 6.9,8.15 | C9.1 16.85,8.2 16.8,8.15 | C11.1 21.85,8.2 21.8,8.15 | C15.1 26.85,8.2 26.8,8.15 | C13.1 31.85,8.2 31.8,8.15 | C10.1 36.85,8.2 36.8,8.15 | C19.1 31.85,13.2 31.9,13.15 | C21.1 26.85,13.2 26.8,13.15 | C24.1 16.85,13.2 16.9,13.15 | C20.1 6.85,13.2 6.8,13.15 | C18.1 1.85,13.2 1.8,13.15 | C26.1 1.85,18.2 1.8,18.15
  Bottom 0.4: C28.1 6.85,18.3 6.7,18.15 | C30.1 11.95,18.25 12.05,18.15 | C25.1 21.85,18.2 21.9,18.15 | C27.1 26.85,18.2 26.9,18.15 | C29.1 31.85,18.3 31.7,18.15 | C37.1 31.85,23.2 31.8,23.15 | C35.1 26.85,23.2 26.9,23.15 | C33.1 21.85,23.2 21.8,23.15 | C40.1 16.85,23.2 16.9,23.15 | C38.1 11.85,23.2 11.8,23.15 | C36.1 6.85,23.2 6.8,23.15 | C34.1 1.85,23.2 1.8,23.15 | C44.1 11.95,28.2 11.9,28.15 | C43.1 16.85,28.2 16.8,28.15 | C46.1 21.85,28.2 21.9,28.15 | C45.1 26.85,28.2 26.8,28.15 | C48.1 36.85,28.2 36.8,28.15 | C56.1 36.85,33.2 36.9,33.15 | C55.1 31.85,33.2 31.8,33.15 | C53.1 26.85,33.2 26.8,33.15 | C54.1 21.85,33.2 21.8,33.15 | C51.1 16.85,33.2 16.8,33.15 | C52.1 11.85,33.2 11.8,33.15 | C49.1 6.85,33.2 6.8,33.15 | C50.1 1.85,33.2 1.8,33.15 | C39.1 36.85,23.2 36.8,23.15 | C31.1 36.85,18.2 36.8,18.15
  pour Route15: 0,0 40,0 40,10 arc-90 41,11 52,11 arc90 54,13 54,27 arc90 52,29 41,29 arc-90 40,30 40,40 0,40

### Text on the board
tNames: 0 | Y | 7 | X | Hall Sensor Array | 7